# Altium schematic sheet PHOTODIODE.SchDoc
size 420 x 297 mm; SheetNumber: 5; SheetTotal: 5
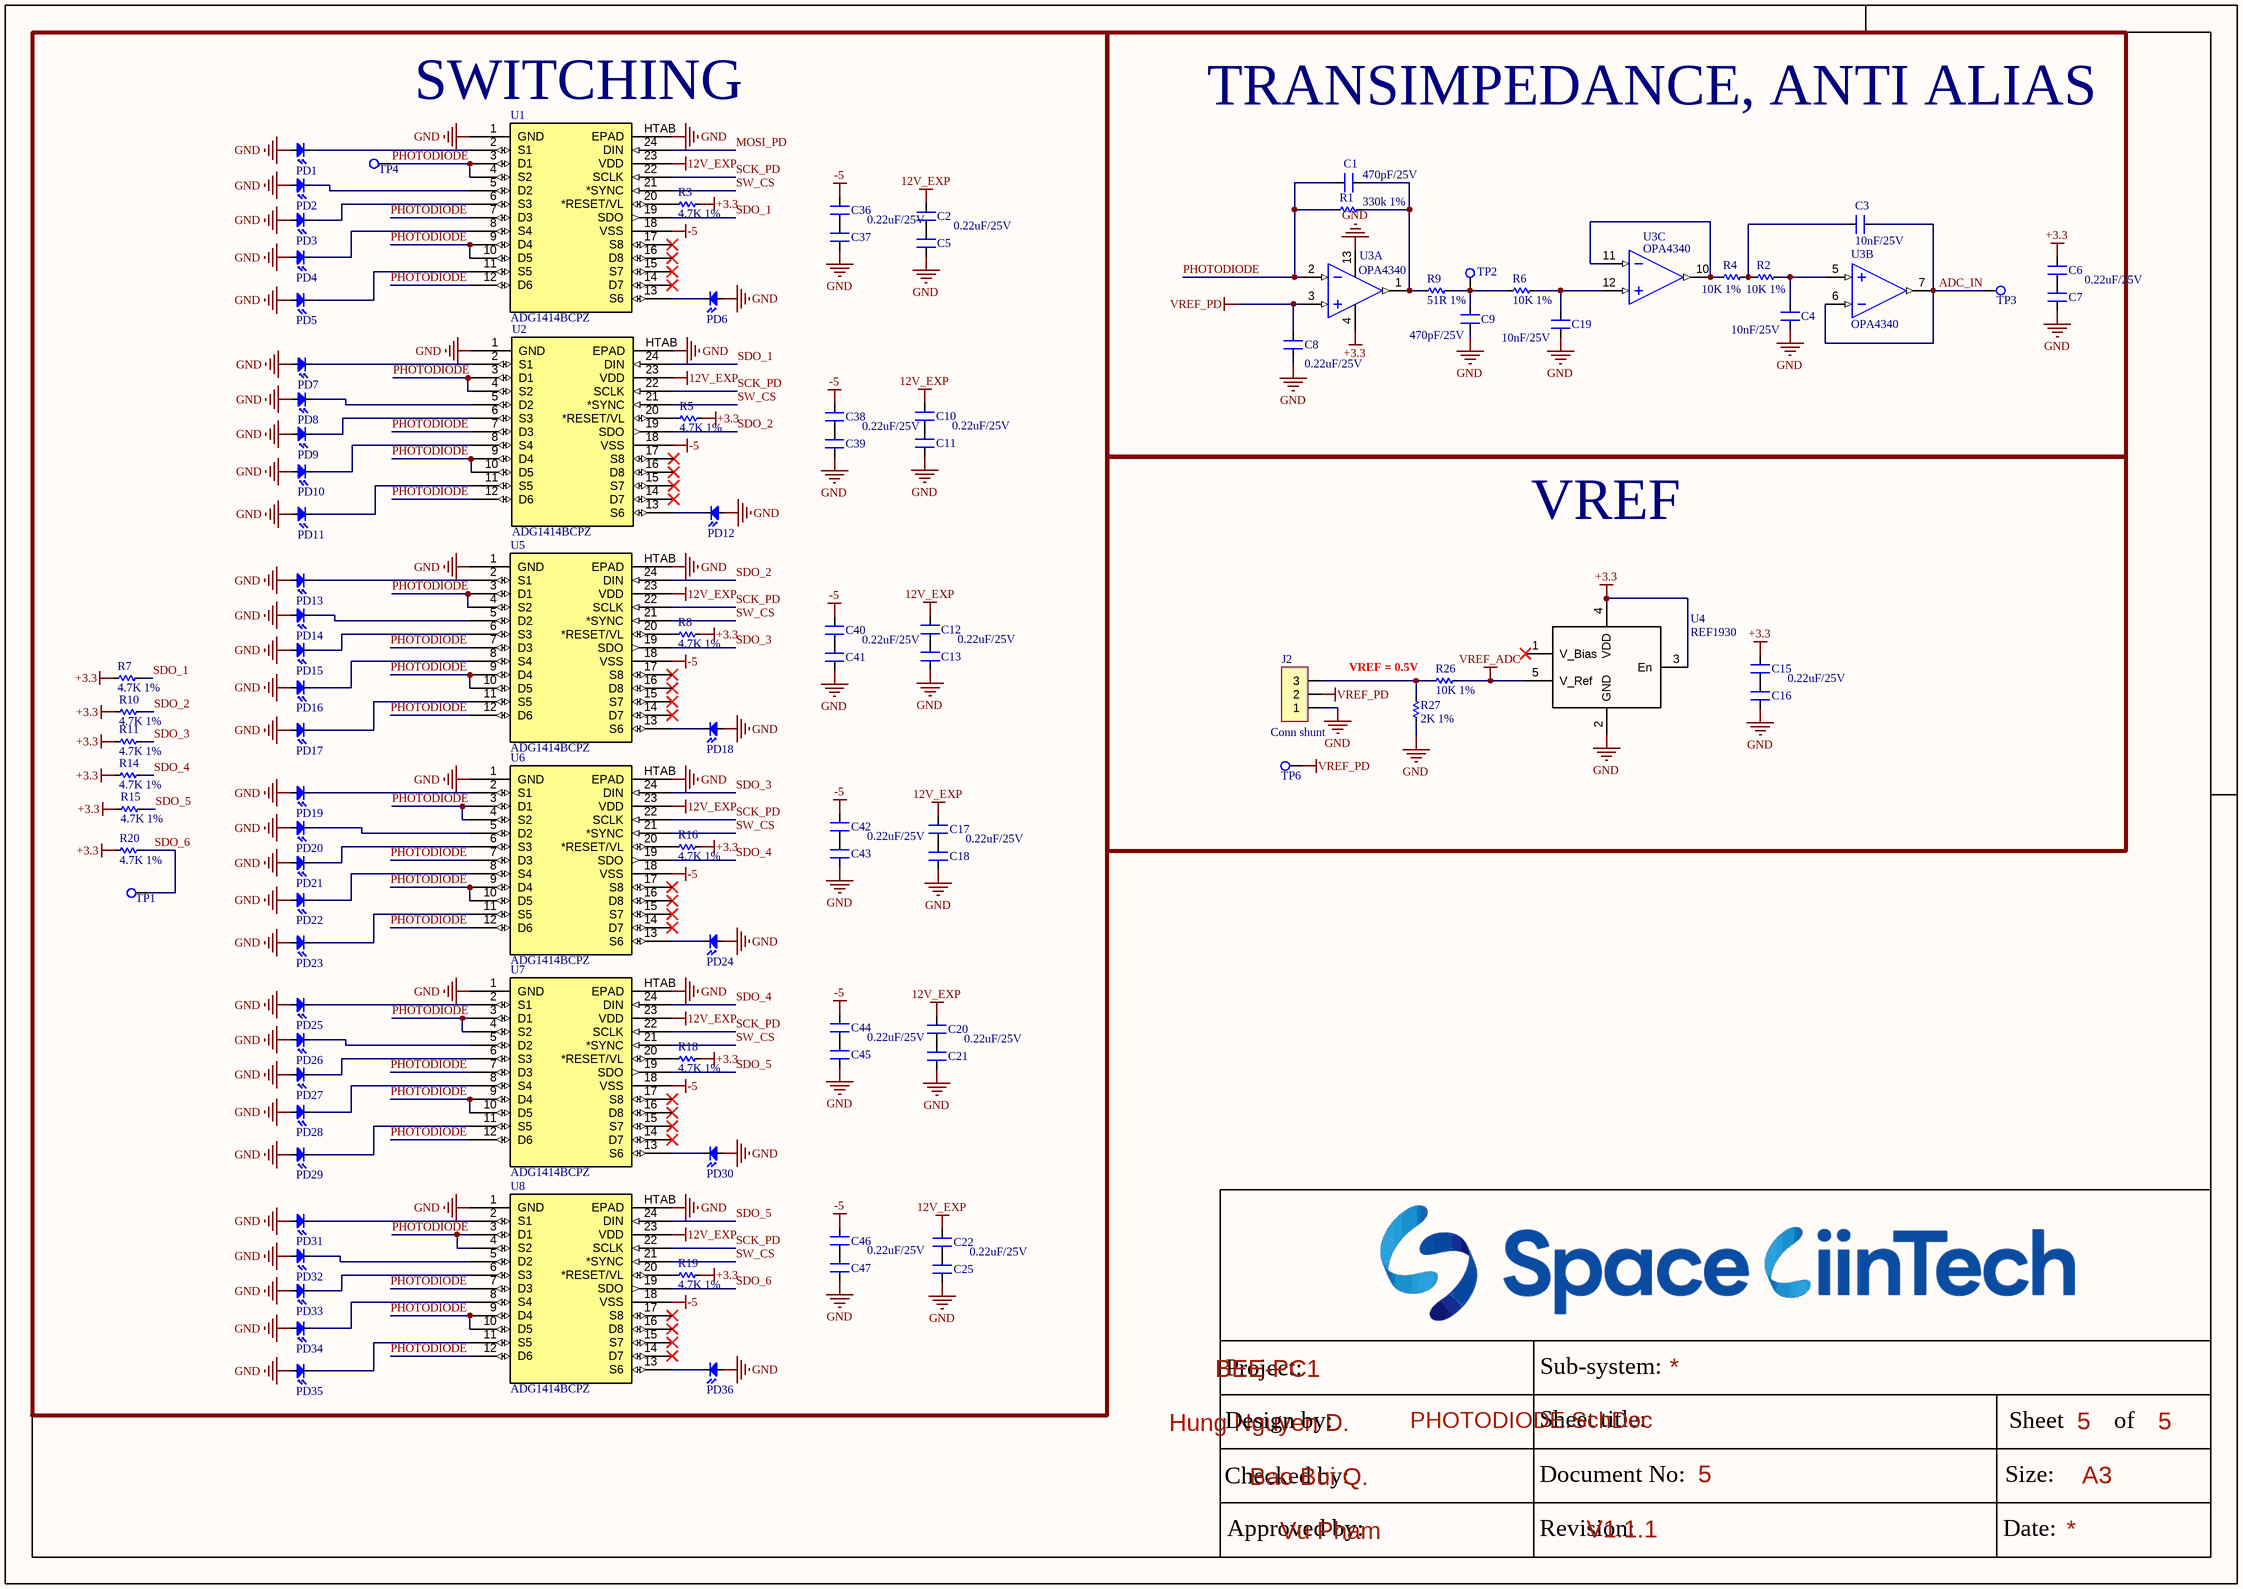
[diagram p0: PHOTODIODE.SchDoc]

## Parts
C1  470pF/25V  [CN-SMD-0603]
C2  0.22uF/25V  [CN-SMD-0603]
C3  10nF/25V  [CN-SMD-0603]
C4  10nF/25V  [CN-SMD-0603]
C5  0.22uF/25V  [CN-SMD-0603]  (value not drawn)
C6  0.22uF/25V  [CN-SMD-0603]
C7  0.22uF/25V  [CN-SMD-0603]  (value not drawn)
C8  0.22uF/25V  [CN-SMD-0603]
C9  470pF/25V  [CN-SMD-0603]
C10  0.22uF/25V  [CN-SMD-0603]
C11  0.22uF/25V  [CN-SMD-0603]  (value not drawn)
C12  0.22uF/25V  [CN-SMD-0603]
C13  0.22uF/25V  [CN-SMD-0603]  (value not drawn)
C15  0.22uF/25V  [CN-SMD-0603]
C16  0.22uF/25V  [CN-SMD-0603]  (value not drawn)
C17  0.22uF/25V  [CN-SMD-0603]
C18  0.22uF/25V  [CN-SMD-0603]  (value not drawn)
C19  10nF/25V  [CN-SMD-0603]
C20  0.22uF/25V  [CN-SMD-0603]
C21  0.22uF/25V  [CN-SMD-0603]  (value not drawn)
C22  0.22uF/25V  [CN-SMD-0603]
C25  0.22uF/25V  [CN-SMD-0603]  (value not drawn)
C36  0.22uF/25V  [CN-SMD-0603]
C37  0.22uF/25V  [CN-SMD-0603]  (value not drawn)
C38  0.22uF/25V  [CN-SMD-0603]
C39  0.22uF/25V  [CN-SMD-0603]  (value not drawn)
C40  0.22uF/25V  [CN-SMD-0603]
C41  0.22uF/25V  [CN-SMD-0603]  (value not drawn)
C42  0.22uF/25V  [CN-SMD-0603]
C43  0.22uF/25V  [CN-SMD-0603]  (value not drawn)
C44  0.22uF/25V  [CN-SMD-0603]
C45  0.22uF/25V  [CN-SMD-0603]  (value not drawn)
C46  0.22uF/25V  [CN-SMD-0603]
C47  0.22uF/25V  [CN-SMD-0603]  (value not drawn)
J2  Conn shunt  [M50-3930342]
PD1  Photodiode  [VEMD5080X01]  (value not drawn)
PD2  Photodiode  [VEMD5080X01]  (value not drawn)
PD3  Photodiode  [VEMD5080X01]  (value not drawn)
PD4  Photodiode  [VEMD5080X01]  (value not drawn)
PD5  Photodiode  [VEMD5080X01]  (value not drawn)
PD6  Photodiode  [VEMD5080X01]  (value not drawn)
PD7  Photodiode  [VEMD5080X01]  (value not drawn)
PD8  Photodiode  [VEMD5080X01]  (value not drawn)
PD9  Photodiode  [VEMD5080X01]  (value not drawn)
PD10  Photodiode  [VEMD5080X01]  (value not drawn)
PD11  Photodiode  [VEMD5080X01]  (value not drawn)
PD12  Photodiode  [VEMD5080X01]  (value not drawn)
PD13  Photodiode  [VEMD5080X01]  (value not drawn)
PD14  Photodiode  [VEMD5080X01]  (value not drawn)
PD15  Photodiode  [VEMD5080X01]  (value not drawn)
PD16  Photodiode  [VEMD5080X01]  (value not drawn)
PD17  Photodiode  [VEMD5080X01]  (value not drawn)
PD18  Photodiode  [VEMD5080X01]  (value not drawn)
PD19  Photodiode  [VEMD5080X01]  (value not drawn)
PD20  Photodiode  [VEMD5080X01]  (value not drawn)
PD21  Photodiode  [VEMD5080X01]  (value not drawn)
PD22  Photodiode  [VEMD5080X01]  (value not drawn)
PD23  Photodiode  [VEMD5080X01]  (value not drawn)
PD24  Photodiode  [VEMD5080X01]  (value not drawn)
PD25  Photodiode  [VEMD5080X01]  (value not drawn)
PD26  Photodiode  [VEMD5080X01]  (value not drawn)
PD27  Photodiode  [VEMD5080X01]  (value not drawn)
PD28  Photodiode  [VEMD5080X01]  (value not drawn)
PD29  Photodiode  [VEMD5080X01]  (value not drawn)
PD30  Photodiode  [VEMD5080X01]  (value not drawn)
PD31  Photodiode  [VEMD5080X01]  (value not drawn)
PD32  Photodiode  [VEMD5080X01]  (value not drawn)
PD33  Photodiode  [VEMD5080X01]  (value not drawn)
PD34  Photodiode  [VEMD5080X01]  (value not drawn)
PD35  Photodiode  [VEMD5080X01]  (value not drawn)
PD36  Photodiode  [VEMD5080X01]  (value not drawn)
R1  330k 1%  [RES-SMD-0603]
R2  10K 1%  [RES-SMD-0603]
R3  4.7K 1%  [RES-SMD-0603]
R4  10K 1%  [RES-SMD-0603]
R5  4.7K 1%  [RES-SMD-0603]
R6  10K 1%  [RES-SMD-0603]
R7  4.7K 1%  [RES-SMD-0603]
R8  4.7K 1%  [RES-SMD-0603]
R9  51R 1%  [RES-SMD-0603]
R10  4.7K 1%  [RES-SMD-0603]
R11  4.7K 1%  [RES-SMD-0603]
R14  4.7K 1%  [RES-SMD-0603]
R15  4.7K 1%  [RES-SMD-0603]
R16  4.7K 1%  [RES-SMD-0603]
R18  4.7K 1%  [RES-SMD-0603]
R19  4.7K 1%  [RES-SMD-0603]
R20  4.7K 1%  [RES-SMD-0603]
R26  10K 1%  [RES-SMD-0603]
R27  2K 1%  [RES-SMD-0603]
TP1  Test_Point  [TESTPOINT]  (value not drawn)
TP2  Test_Point  [TESTPOINT]  (value not drawn)
TP3  Test_Point  [TESTPOINT]  (value not drawn)
TP4  Test_Point  [TESTPOINT]  (value not drawn)
TP6  Test_Point  [TESTPOINT]  (value not drawn)
U1  ADG1414BCPZ  [ADG1414BCPZ]
U2  ADG1414BCPZ  [ADG1414BCPZ]
U3  OPA4340  [SSOP16]  (parts A,B,C of 4)
U4  REF1930  [SOT23-5]
U5  ADG1414BCPZ  [ADG1414BCPZ]
U6  ADG1414BCPZ  [ADG1414BCPZ]
U7  ADG1414BCPZ  [ADG1414BCPZ]
U8  ADG1414BCPZ  [ADG1414BCPZ]

## Blocks framed on the sheet
SWITCHING: C2 C5 C10-C13 C17 C18 C20-C22 C25 C36-C47 PD1-PD36 R3 R5 R7 R8 R10 R11 R14-R16 R18-R20 TP1 TP4 U1 U2 U5-U8
TRANSIMPEDANCE, ANTI ALIAS: C1 C3 C4 C6-C9 C19 R1 R2 R4 R6 R9 TP2 TP3 U3
VREF: C15 C16 J2 R26 R27 TP6 U4

## Nets
12V_EXP: C2.2 C10.2 C12.2 C17.2 C20.2 C22.2 U1.23(VDD) U2.23(VDD) U5.23(VDD) U6.23(VDD) U7.23(VDD) U8.23(VDD)
+3.3: C6.2 C15.2 R3.2 R5.2 R7.2 R8.2 R10.2 R11.2 R14.2 R15.2 R16.2 R18.2 R19.2 R20.2 U3.4(+V) U4.3(En) U4.4(VDD)
-5: C36.2 C38.2 C40.2 C42.2 C44.2 C46.2 U1.18(VSS) U2.18(VSS) U5.18(VSS) U6.18(VSS) U7.18(VSS) U8.18(VSS)
GND: C4.1 C5.1 C7.1 C8.1 C9.1 C11.1 C13.1 C16.1 C18.1 C19.1 C21.1 C25.1 C37.1 C39.1 C41.1 C43.1 C45.1 C47.1 J2.1 PD1.1(A) PD2.1(A) PD3.1(A) PD4.1(A) PD5.1(A) PD6.1(A) PD7.1(A) PD8.1(A) PD9.1(A) PD10.1(A) PD11.1(A) PD12.1(A) PD13.1(A) PD14.1(A) PD15.1(A) PD16.1(A) PD17.1(A) PD18.1(A) PD19.1(A) PD20.1(A) PD21.1(A) PD22.1(A) PD23.1(A) PD24.1(A) PD25.1(A) PD26.1(A) PD27.1(A) PD28.1(A) PD29.1(A) PD30.1(A) PD31.1(A) PD32.1(A) PD33.1(A) PD34.1(A) PD35.1(A) PD36.1(A) R27.1 U1.1(GND) U1.HTAB(EPAD) U2.1(GND) U2.HTAB(EPAD) U3.13(-V) U4.2(GND) U5.1(GND) U5.HTAB(EPAD) U6.1(GND) U6.HTAB(EPAD) U7.1(GND) U7.HTAB(EPAD) U8.1(GND) U8.HTAB(EPAD)
VREF_ADC: R26.1 U4.5(V_Ref)
VREF_PD: C8.2 J2.2 TP6.1 U3.3(IN+)
ADC_IN: C3.1 TP3.1 U3.6(IN-) U3.7(OUT)
MOSI_PD: U1.24(DIN)
PHOTODIODE: C1.1 R1.1 TP4.1 U1.3(D1) U1.4(S2) U1.7(D3) U1.9(D4) U1.10(D5) U1.12(D6) U2.3(D1) U2.4(S2) U2.7(D3) U2.9(D4) U2.10(D5) U2.12(D6) U3.2(IN-) U5.3(D1) U5.4(S2) U5.7(D3) U5.9(D4) U5.10(D5) U5.12(D6) U6.3(D1) U6.4(S2) U6.7(D3) U6.9(D4) U6.10(D5) U6.12(D6) U7.3(D1) U7.4(S2) U7.7(D3) U7.9(D4) U7.10(D5) U7.12(D6) U8.3(D1) U8.4(S2) U8.7(D3) U8.9(D4) U8.10(D5) U8.12(D6)
SCK_PD: U1.22(SCLK) U2.22(SCLK) U5.22(SCLK) U6.22(SCLK) U7.22(SCLK) U8.22(SCLK)
SDO_1: R7.1 U1.19(SDO) U2.24(DIN)
SDO_2: R10.1 U2.19(SDO) U5.24(DIN)
SDO_3: R11.1 U5.19(SDO) U6.24(DIN)
SDO_4: R14.1 U6.19(SDO) U7.24(DIN)
SDO_5: R15.1 U7.19(SDO) U8.24(DIN)
SDO_6: R20.1 TP1.1 U8.19(SDO)
SW_CS: U1.21(*SYNC) U2.21(*SYNC) U5.21(*SYNC) U6.21(*SYNC) U7.21(*SYNC) U8.21(*SYNC)
NetC1_2: C1.2 R1.2 R9.1 U3.1(OUT)
NetC2_1: C2.1 C5.2
NetC3_2: C3.2 R2.1 R4.2
NetC4_2: C4.2 R2.2 U3.5(IN+)
NetC6_1: C6.1 C7.2
NetC9_2: C9.2 R6.1 R9.2 TP2.1
NetC10_1: C10.1 C11.2
NetC12_1: C12.1 C13.2
NetC15_1: C15.1 C16.2
NetC17_1: C17.1 C18.2
NetC19_2: C19.2 R6.2 U3.12(IN+)
NetC20_1: C20.1 C21.2
NetC22_1: C22.1 C25.2
NetC36_1: C36.1 C37.2
NetC38_1: C38.1 C39.2
NetC40_1: C40.1 C41.2
NetC42_1: C42.1 C43.2
NetC44_1: C44.1 C45.2
NetC46_1: C46.1 C47.2
NetJ2_3: J2.3 R26.2 R27.2
NetPD1_2: PD1.2(K) U1.2(S1)
NetPD2_2: PD2.2(K) U1.5(D2)
NetPD3_2: PD3.2(K) U1.6(S3)
NetPD4_2: PD4.2(K) U1.8(S4)
NetPD5_2: PD5.2(K) U1.11(S5)
NetPD6_2: PD6.2(K) U1.13(S6)
NetPD7_2: PD7.2(K) U2.2(S1)
NetPD8_2: PD8.2(K) U2.5(D2)
NetPD9_2: PD9.2(K) U2.6(S3)
NetPD10_2: PD10.2(K) U2.8(S4)
NetPD11_2: PD11.2(K) U2.11(S5)
NetPD12_2: PD12.2(K) U2.13(S6)
NetPD13_2: PD13.2(K) U5.2(S1)
NetPD14_2: PD14.2(K) U5.5(D2)
NetPD15_2: PD15.2(K) U5.6(S3)
NetPD16_2: PD16.2(K) U5.8(S4)
NetPD17_2: PD17.2(K) U5.11(S5)
NetPD18_2: PD18.2(K) U5.13(S6)
NetPD19_2: PD19.2(K) U6.2(S1)
NetPD20_2: PD20.2(K) U6.5(D2)
NetPD21_2: PD21.2(K) U6.6(S3)
NetPD22_2: PD22.2(K) U6.8(S4)
NetPD23_2: PD23.2(K) U6.11(S5)
NetPD24_2: PD24.2(K) U6.13(S6)
NetPD25_2: PD25.2(K) U7.2(S1)
NetPD26_2: PD26.2(K) U7.5(D2)
NetPD27_2: PD27.2(K) U7.6(S3)
NetPD28_2: PD28.2(K) U7.8(S4)
NetPD29_2: PD29.2(K) U7.11(S5)
NetPD30_2: PD30.2(K) U7.13(S6)
NetPD31_2: PD31.2(K) U8.2(S1)
NetPD32_2: PD32.2(K) U8.5(D2)
NetPD33_2: PD33.2(K) U8.6(S3)
NetPD34_2: PD34.2(K) U8.8(S4)
NetPD35_2: PD35.2(K) U8.11(S5)
NetPD36_2: PD36.2(K) U8.13(S6)
NetR3_1: R3.1 U1.20(*RESET/VL)
NetR4_1: R4.1 U3.10(OUT) U3.11(IN-)
NetR5_1: R5.1 U2.20(*RESET/VL)
NetR8_1: R8.1 U5.20(*RESET/VL)
NetR16_1: R16.1 U6.20(*RESET/VL)
NetR18_1: R18.1 U7.20(*RESET/VL)
NetR19_1: R19.1 U8.20(*RESET/VL)

Not connected (* = marked no-connect by the designer): U1 14(D7)* 15(S7)* 16(D8)* 17(S8)*; U2 14(D7)* 15(S7)* 16(D8)* 17(S8)*; U4 1(V_Bias)*; U5 14(D7)* 15(S7)* 16(D8)* 17(S8)*; U6 14(D7)* 15(S7)* 16(D8)* 17(S8)*; U7 14(D7)* 15(S7)* 16(D8)* 17(S8)*; U8 14(D7)* 15(S7)* 16(D8)* 17(S8)*

## Notes on the sheet
- VREF = 0.5V
- Project:
- BEE-PC1
- Sub-system:
- Design by:
- Hung Nguyen D.
- Bao Bui Q.
- Sheet title:
- Sheet
- A3
- of
- Checked by:
- Approved by:
- Vu Pham
- Revision:
- Document No:
- V1.1.1
- Size:
- Date:

## Library data of the parts
C1-C13 C15-C22 C25 C36-C47 = CM: 0603; Value: 103
J2 = JP3: WR-PHD 2.54 mm Angled Socket Header; Manufacturer: W¨¹rth Elektronik eiSos GmbH; partNo: 613003143121; ComponentLink1 Description: Manufacturer; ComponentLink2 Description: Datasheet; NoPins: 03; Created Date: 29 March 2013; ComponentLink1URL: http://www.we-online.com; ComponentLink2URL: http://katalog.we-online.de/em/datasheet/6130xx143121.pdf; Created by: Karrer Zheng
R1-R11 R14-R16 R18-R20 R26 R27 = Res-SMD: 0603; Manufacturer: Generic Components; Class: Passive; Published: 08/06/2000; Publisher: Altium Hobart Technology Centre
U1 U2 U5-U8 = ADG1414: IC SW SPST-NOX8 11.5OHM 24LFCSP
U3 = OPA4340: IC CMOS 4 CIRCUIT 16SSOP; Supplier 1: Mouser; Supplier Part Number 1: 595-OPA4340UA/2K5
U4 = REF19xx: REF1941AIDDCT